# Altium schematic sheet ADC.SchDoc: ADC
size Letter; DrawnBy: AdamGilbert; Engineer: AdamGilbert; Revision: Rev0
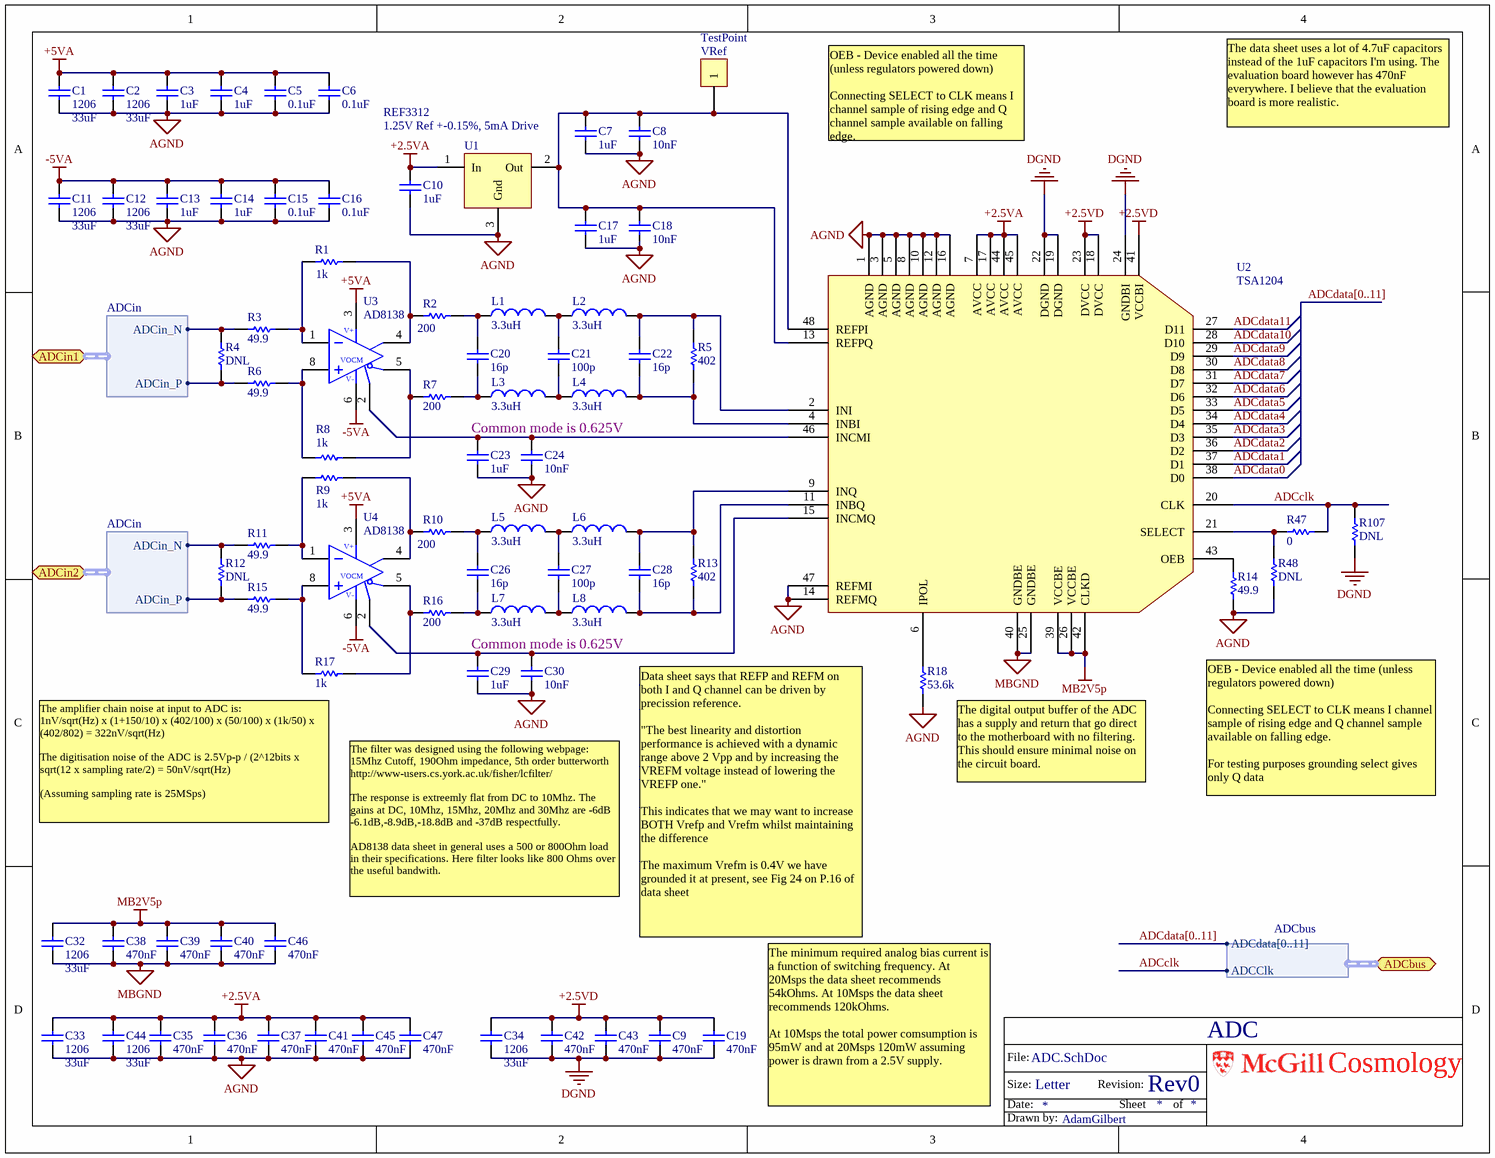
[diagram p0: ADC.SchDoc]

## Parts
C1  Footprint: 1206  [CC3225-1210]  (hidden comment: 33uF)
C2  Footprint: 1206  [CC3225-1210]  (hidden comment: 33uF)
C3  1uF  [0603]
C4  1uF  [0603]
C5  0.1uF  [0603]
C6  0.1uF  [0603]
C7  1uF  [0603]
C8  10nF  [0603]
C9  470nF  [0603]
C10  1uF  [0603]
C11  Footprint: 1206  [CC3225-1210]  (hidden comment: 33uF)
C12  Footprint: 1206  [CC3225-1210]  (hidden comment: 33uF)
C13  1uF  [0603]
C14  1uF  [0603]
C15  0.1uF  [0603]
C16  0.1uF  [0603]
C17  1uF  [0603]
C18  10nF  [0603]
C19  470nF  [0603]
C20  16p  [0603]
C21  100p  [0603]
C22  16p  [0603]
C23  1uF  [0603]
C24  10nF  [0603]
C26  16p  [0603]
C27  100p  [0603]
C28  16p  [0603]
C29  1uF  [0603]
C30  10nF  [0603]
C32  Footprint: 1206  [CC3225-1210]  (hidden comment: 33uF)
C33  Footprint: 1206  [CC3225-1210]  (hidden comment: 33uF)
C34  Footprint: 1206  [CC3225-1210]  (hidden comment: 33uF)
C35  470nF  [0603]
C36  470nF  [0603]
C37  470nF  [0603]
C38  470nF  [0603]
C39  470nF  [0603]
C40  470nF  [0603]
C41  470nF  [0603]
C42  470nF  [0603]
C43  470nF  [0603]
C44  Footprint: 1206  [CC3225-1210]  (hidden comment: 33uF)
C45  470nF  [0603]
C46  470nF  [0603]
C47  470nF  [0603]
L1  3.3uH  [0603]
L2  3.3uH  [0603]
L3  3.3uH  [0603]
L4  3.3uH  [0603]
L5  3.3uH  [0603]
L6  3.3uH  [0603]
L7  3.3uH  [0603]
L8  3.3uH  [0603]
R1  1k  [0603]
R2  200  [0603]
R3  49.9  [0603]
R4  DNL  [0603]
R5  402  [0603]
R6  49.9  [0603]
R7  200  [0603]
R8  1k  [0603]
R9  1k  [0603]
R10  200  [0603]
R11  49.9  [0603]
R12  DNL  [0603]
R13  402  [0603]
R14  49.9  [0603]
R15  49.9  [0603]
R16  200  [0603]
R17  1k  [0603]
R18  53.6k  [0603]
R47  0  [0603]
R48  DNL  [0603]
R107  DNL  [0603]
U1  REF3312  Description: 1.25V Ref +-0.15%, 5mA Drive  [SOT23]
U2  TSA1204  [TSQFP50P900X900X160-48N]
U3  AD8138  [SO8]
U4  AD8138  [SO8]
VRef  TestPoint  [TP-3520-SK]  (no BOM)

## Ports
ADCbus (harness ADCbus), ADCin1 (harness ADCin), ADCin2 (harness ADCin)

## Harnesses
ADCin: ADCin_P, ADCin_N
ADCbus: ADCdata[0..11], ADCClk

## Nets
+2.5VA: C10.2 C33.2 C35.2 C36.2 C37.2 C41.2 C44.2 C45.2 C47.2 U1.1(In) U2.7(AVCC) U2.17(AVCC) U2.44(AVCC) U2.45(AVCC)
+2.5VD: C9.2 C19.2 C34.2 C42.2 C43.2 U2.18(DVCC) U2.23(DVCC) U2.41(VCCBI)
+5VA: C1.2 C2.2 C3.2 C4.2 C5.1 C6.1 U3.3(V+) U4.3(V+)
-5VA: C11.2 C12.2 C13.2 C14.2 C15.1 C16.1 U3.6(V-) U4.6(V-)
AGND: C1.1 C2.1 C3.1 C4.1 C5.2 C6.2 C7.1 C8.1 C10.1 C11.1 C12.1 C13.1 C14.1 C15.2 C16.2 C17.1 C18.1 C23.1 C24.1 C29.1 C30.1 C33.1 C35.1 C36.1 C37.1 C41.1 C44.1 C45.1 C47.1 R14.1 R18.1 R48.2 U1.3(Gnd) U2.1(AGND) U2.3(AGND) U2.5(AGND) U2.8(AGND) U2.10(AGND) U2.12(AGND) U2.14(REFMQ) U2.16(AGND) U2.47(REFMI)
DGND: C9.1 C19.1 C34.1 C42.1 C43.1 R107.1 U2.19(DGND) U2.22(DGND) U2.24(GNDBI)
MB2V5p: C32.2 C38.2 C39.2 C40.2 C46.2 U2.26(VCCBE) U2.39(VCCBE) U2.42(CLKD)
MBGND: C32.1 C38.1 C39.1 C40.1 C46.1 U2.25(GNDBE) U2.40(GNDBE)
ADCclk: R47.1 R107.2 U2.20(CLK) ; port ADCbus.ADCClk
ADCdata0: U2.38(D0)
ADCdata1: U2.37(D1)
ADCdata2: U2.36(D2)
ADCdata3: U2.35(D3)
ADCdata4: U2.34(D4)
ADCdata5: U2.33(D5)
ADCdata6: U2.32(D6)
ADCdata7: U2.31(D7)
ADCdata8: U2.30(D8)
ADCdata9: U2.29(D9)
ADCdata10: U2.28(D10)
ADCdata11: U2.27(D11)
NetC7_2: C7.2 C8.2 C17.2 C18.2 U1.2(Out) U2.13(REFPQ) U2.48(REFPI) VRef.1
NetC20_1: C20.1 L3.1 R7.1
NetC20_2: C20.2 L1.1 R2.1
NetC21_1: C21.1 L3.2 L4.1
NetC21_2: C21.2 L1.2 L2.1
NetC22_1: C22.1 L4.2 R5.2 U2.4(INBI)
NetC22_2: C22.2 L2.2 R5.1 U2.2(INI)
NetC23_2: C23.2 C24.2 U2.46(INCMI) U3.2(VOCM)
NetC26_1: C26.1 L7.1 R16.1
NetC26_2: C26.2 L5.1 R10.1
NetC27_1: C27.1 L7.2 L8.1
NetC27_2: C27.2 L5.2 L6.1
NetC28_1: C28.1 L8.2 R13.2 U2.11(INBQ)
NetC28_2: C28.2 L6.2 R13.1 U2.9(INQ)
NetC29_2: C29.2 C30.2 U2.15(INCMQ) U4.2(VOCM)
NetR1_1: R1.1 R2.2 U3.4(OUT+)
NetR1_2: R1.2 R3.1 U3.1(IN-)
NetR3_2: R3.2 R4.2 ; port ADCin1.ADCin_N
NetR4_1: R4.1 R6.2 ; port ADCin1.ADCin_P
NetR6_1: R6.1 R8.2 U3.8(IN+)
NetR7_2: R7.2 R8.1 U3.5(OUT-)
NetR9_1: R9.1 R10.2 U4.4(OUT+)
NetR9_2: R9.2 R11.1 U4.1(IN-)
NetR11_2: R11.2 R12.2 ; port ADCin2.ADCin_N
NetR12_1: R12.1 R15.2 ; port ADCin2.ADCin_P
NetR14_2: R14.2 U2.43(OEB)
NetR15_1: R15.1 R17.2 U4.8(IN+)
NetR16_2: R16.2 R17.1 U4.5(OUT-)
NetR18_2: R18.2 U2.6(IPOL)
NetR47_2: R47.2 R48.1 U2.21(SELECT)

Not connected (* = marked no-connect by the designer): U3 7(NC); U4 7(NC)

## Buses and harness runs
bus ADCdata[0..11]

## Notes on the sheet
- OEB - Device enabled all the time (unless regulators powered down)
  Connecting SELECT to CLK means I channel sample of rising edge and Q channel sample available on falling edge.
  For testing purposes grounding select gives only Q data
- The data sheet uses a lot of 4.7uF capacitors instead of the 1uF capacitors I'm using. The evaluation board however has 470nF everywhere. I believe that the evaluation board is more realistic.
- Common mode is 0.625V
- (near R18) The digital output buffer of the ADC has a supply and return that go direct to the motherboard with no filtering. This should ensure minimal noise on the circuit board.
- (near R17) The amplifier chain noise at input to ADC is:
  1nV/sqrt(Hz) x (1+150/10) x (402/100) x (50/100) x (1k/50) x (402/802) = 322nV/sqrt(Hz)
  The digitisation noise of the ADC is 2.5Vp-p / (2^12bits x sqrt(12 x sampling rate/2) = 50nV/sqrt(Hz)
  (Assuming sampling rate is 25MSps)
- The filter was designed using the following webpage:
  15Mhz Cutoff, 190Ohm impedance, 5th order butterworth
  http://www-users.cs.york.ac.uk/fisher/lcfilter/
  The response is extreemly flat from DC to 10Mhz. The gains at DC, 10Mhz, 15Mhz, 20Mhz and 30Mhz are -6dB -6.1dB,-8.9dB,-18.8dB and -37dB respectfully.
  AD8138 data sheet in general uses a 500 or 800Ohm load in their specifications. Here filter looks like 800 Ohms over the useful bandwith.
- Data sheet says that REFP and REFM on both I and Q channel can be driven by precission reference.
  "The best linearity and distortion performance is achieved with a dynamic range above 2 Vpp and by increasing the VREFM voltage instead of lowering the VREFP one."
  This indicates that we may want to increase BOTH Vrefp and Vrefm whilst maintaining the difference
  The maximum Vrefm is 0.4V we have grounded it at present, see Fig 24 on P.16 of data sheet
- The minimum required analog bias current is a function of switching frequency. At 20Msps the data sheet recommends 54kOhms. At 10Msps the data sheet recommends 120kOhms.
  At 10Msps the total power comsumption is 95mW and at 20Msps 120mW assuming power is drawn from a 2.5V supply.
- File:
- Size:
- Date:
- Letter
- Revision:
- Sheet
- of
- Cosmology
- Drawn by:

## Library data of the parts
C1 C2 C11 C12 C32-C34 C44 = CAP 1210: Capacitor, Ceramic, 1210; Manufacturer: TDK Corporation; Part Constraints: 33uF or 47uF  (1206 or 1210) 25V X5R; Manufacturers Part Number: C3216X5R1E336M; Assembly Comments: none; Type: Capacitor; SupplierUnitCost: $1.1; Value: 33uF; Supplier 1: Digi-Key; Supplier Part Number 1: 445-8046-1-ND
C3 C4 C7 C13 C14 C17 C23 C29 = CAP 0603: Capacitor, Ceramic, 0603; Part Constraints: 10% 16V X7R 0603; Manufacturer: Generic; Manufacturers Part Number: e.g C1608X7R1C105K; Assembly Comments: none; Value: 1uF; Type: Capacitor; SupplierUnitCost: $0.12
C5 C6 C15 C16 C35-C41 C45-C47 = CAP 0603: Capacitor, Ceramic, 0603; Part Constraints: 10% 16V X7R 0603; Manufacturer: Generic; Manufacturers Part Number: Generic; Type: Capacitor; SupplierUnitCost: 0
  C5 C6 C15 C16: Value: 0.1uF
  C35-C41 C45-C47: Value: 470nF
C8 C9 C18-C22 C24 C26-C28 C30 C42 C43 = CAP 0603: Capacitor, Ceramic, 0603; Part Constraints: 10% 16V X7R 0603; Manufacturer: Generic; Assembly Comments: none; Manufacturers Part Number: Generic; Type: Capacitor; SupplierUnitCost: 0
  C8 C18 C24 C30: Value: 10nF
  C9 C19 C42 C43: Value: 470nF
  C20 C22 C26 C28: Value: 16p
  C21 C27: Value: 100p
C10 = CAP 0603: Capacitor, Ceramic, 0603; Part Constraints: 10% 16V X7R 0603; Manufacturer: Generic; Manufacturers Part Number: e.g C1608X7R1C105K; Value: 1uF; Type: Capacitor; SupplierUnitCost: $0.12
L1-L8 = IND 0603: Inductor 0603; Manufacturer: TDK Coporation; Manufacturers Part Number: MLF1608A4R7K; Part Constraints: 30mA 0603 10% shielded 1.6Ohms 80Mhz SRF; Assembly Comments: none; Type: Inductor; SupplierUnitCost: $0.21; Value: 3.3uH; Supplier 1: Digi-Key; Supplier Part Number 1: 445-1021-1-ND
R1-R18 R47 R48 R107 = RES 0603: Resistor; Manufacturer: Generic; Part Constraints: 1% 1/10W 100ppm 0603; Manufacturers Part Number: Generic; Type: Resistor; SupplierUnitCost: 0
  R1 R8 R9 R17: Value: 1k
  R2 R7 R10 R16: Value: 200
  R3 R6 R11 R14 R15: Value: 49.9
  R4 R12 R48 R107: Value: DNL
  R5 R13: Value: 402
  R18: Value: 53.6k
  R47: Value: 0
U1 = REF3312AIDBZT: Vref 1.25V , +-0.15%, 5mA Output, SOT-23-3; Manufacturer: Texas Instruments; Manufacturers Part Number: REF3312AIDBZT; Part Constraints: REF3312AIDBZT; Type: IC; Supplier 1: Digi-Key; Supplier Part Number 1: 296-22635-6-ND
U2 = TSA1204: ADC 2-Channel 12bit; Part Constraints: TSA1204IFT; Manufacturer: STMicroelectronics; Assembly Comments: none; Manufacturers Part Number: TSA1204IFT; Supplier 1: Digi-Key; Supplier Part Number 1: 497-5435-1-ND; Type: IC; SupplierUnitCost: $23.95
U3 U4 = AD8138: IC AMP DIFF LDIST LP 95MA 8SOIC; Manufacturer: Analog Devices Inc; Manufacturers Part Number: AD8138ARZ; Assembly Comments: none; Supplier 1: Digi-Key; RoHS: RoHS Compliant; Category: Integrated Circuits (ICs); Type: IC; Applications: Data Acquisition; Mounting Type: Surface Mount; Package / Case: 8-SOIC (0.154", 3.90mm Width); Supplier Device Package: 8-SOIC; Packaging: Tube; ComponentLink1URL: http://www.analog.com/static/imported-files/data_sheets/AD8138.pdf; ComponentLink1Description: http://www.analog.com/static/imported-files/data_sheets/AD8138.pdf; Part Constraints: AD8138ARZ; SupplierUnitCost: $6.44
VRef = TestPoint: TestPoint1; Assembly Comments: none; Footprint: *; Type: Test Point; SupplierUnitCost: 0